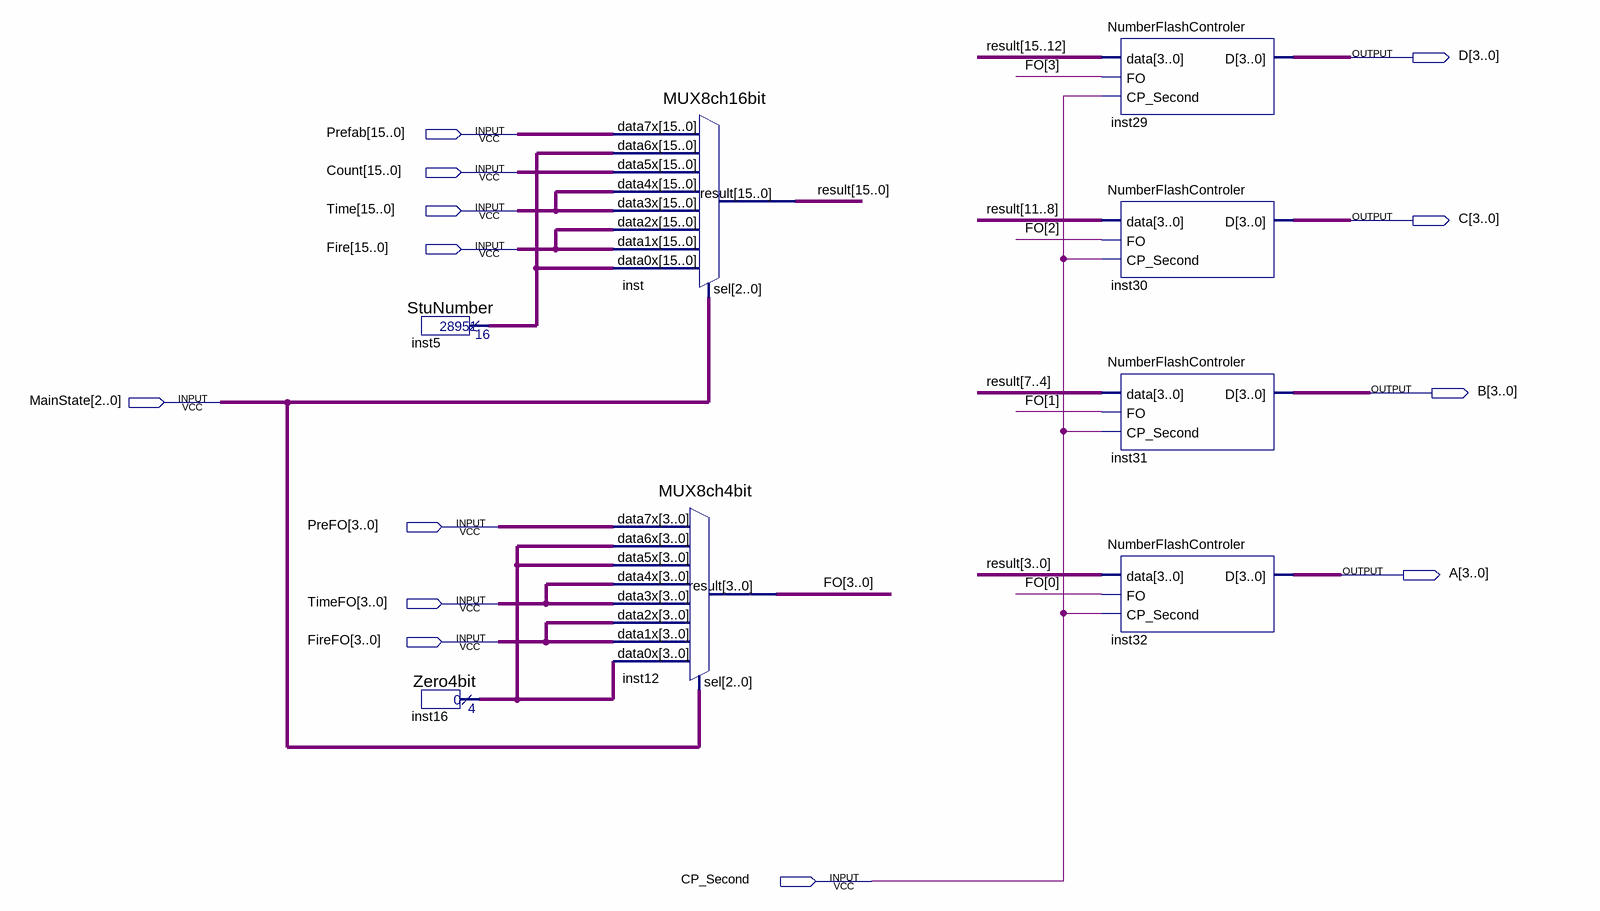
[diagram p0: schematic sheet]
// Quartus schematic Displayer_Number.bdf as structural Verilog: 8 symbols, 13 pins
module Displayer_Number (
  input  [15:0] Prefab,
  input  [15:0] Count,
  input  [15:0] Time,
  input  [15:0] Fire,
  input  [2:0] MainState,
  input  [3:0] PreFO,
  input  [3:0] TimeFO,
  input  [3:0] FireFO,
  input  CP_Second,
  output [3:0] D,
  output [3:0] C,
  output [3:0] B,
  output [3:0] A
);

  wire [3:0] FO, inst16_result;
  wire [15:0] inst5_result, result;

  StuNumber inst5 (.result(inst5_result));
  Zero4bit inst16 (.result(inst16_result));
  MUX8ch16bit inst (
    .data7x(Prefab), .data6x(inst5_result), .data5x(Count), .data4x(Time), .data3x(Time), .data2x(Fire),
    .data1x(Fire), .data0x(inst5_result), .sel(MainState), .result(result));
  MUX8ch4bit inst12 (
    .data7x(PreFO), .data6x(inst16_result), .data5x(inst16_result), .data4x(TimeFO), .data3x(TimeFO),
    .data2x(FireFO), .data1x(FireFO), .data0x(inst16_result), .sel(MainState), .result(FO));
  NumberFlashControler inst29 (.data(result[15:12]), .FO(FO[3]), .CP_Second(CP_Second), .D(D));
  NumberFlashControler inst30 (.data(result[11:8]), .FO(FO[2]), .CP_Second(CP_Second), .D(C));
  NumberFlashControler inst31 (.data(result[7:4]), .FO(FO[1]), .CP_Second(CP_Second), .D(B));
  NumberFlashControler inst32 (.data(result[3:0]), .FO(FO[0]), .CP_Second(CP_Second), .D(A));
endmodule
